# Altium schematic sheet BluetoothHID.SchDoc
size 420 x 297 mm; SheetNumber: 3; SheetTotal: 11; SPICEModelCacheQTASARTU: <root> / <DocumentId>QTASARTU</DocumentId> / <CacheFrame Number="0"> / <Model Name="0603_885012206095_100nf" Kind="CKT"> / <Text>******* / .subckt 0603_885012206095_100nF 1 2 / Rser 1 3 0.0157659152881 / Lser 2 4 3.10171966E-10 / C1 3 4 0.0000001 / Rpar 3 4 5000000000 / .ends 0603_885012206095_100nF</Text> / </Model> / <Model Name="0603_885012106006_10uf" Kind="CKT"> / <Text>******* / .subckt 0603_885012106006_10uF 1 2 / Rser 1 3 0.00407641026021 / Lser 2 4 4.16060333E-10 / C1 3 4 0.00001 / Rpar 3 4 5000000 / .ends 0603_885012106006_10uF</Text> / </Model> / </CacheFrame> / </root>
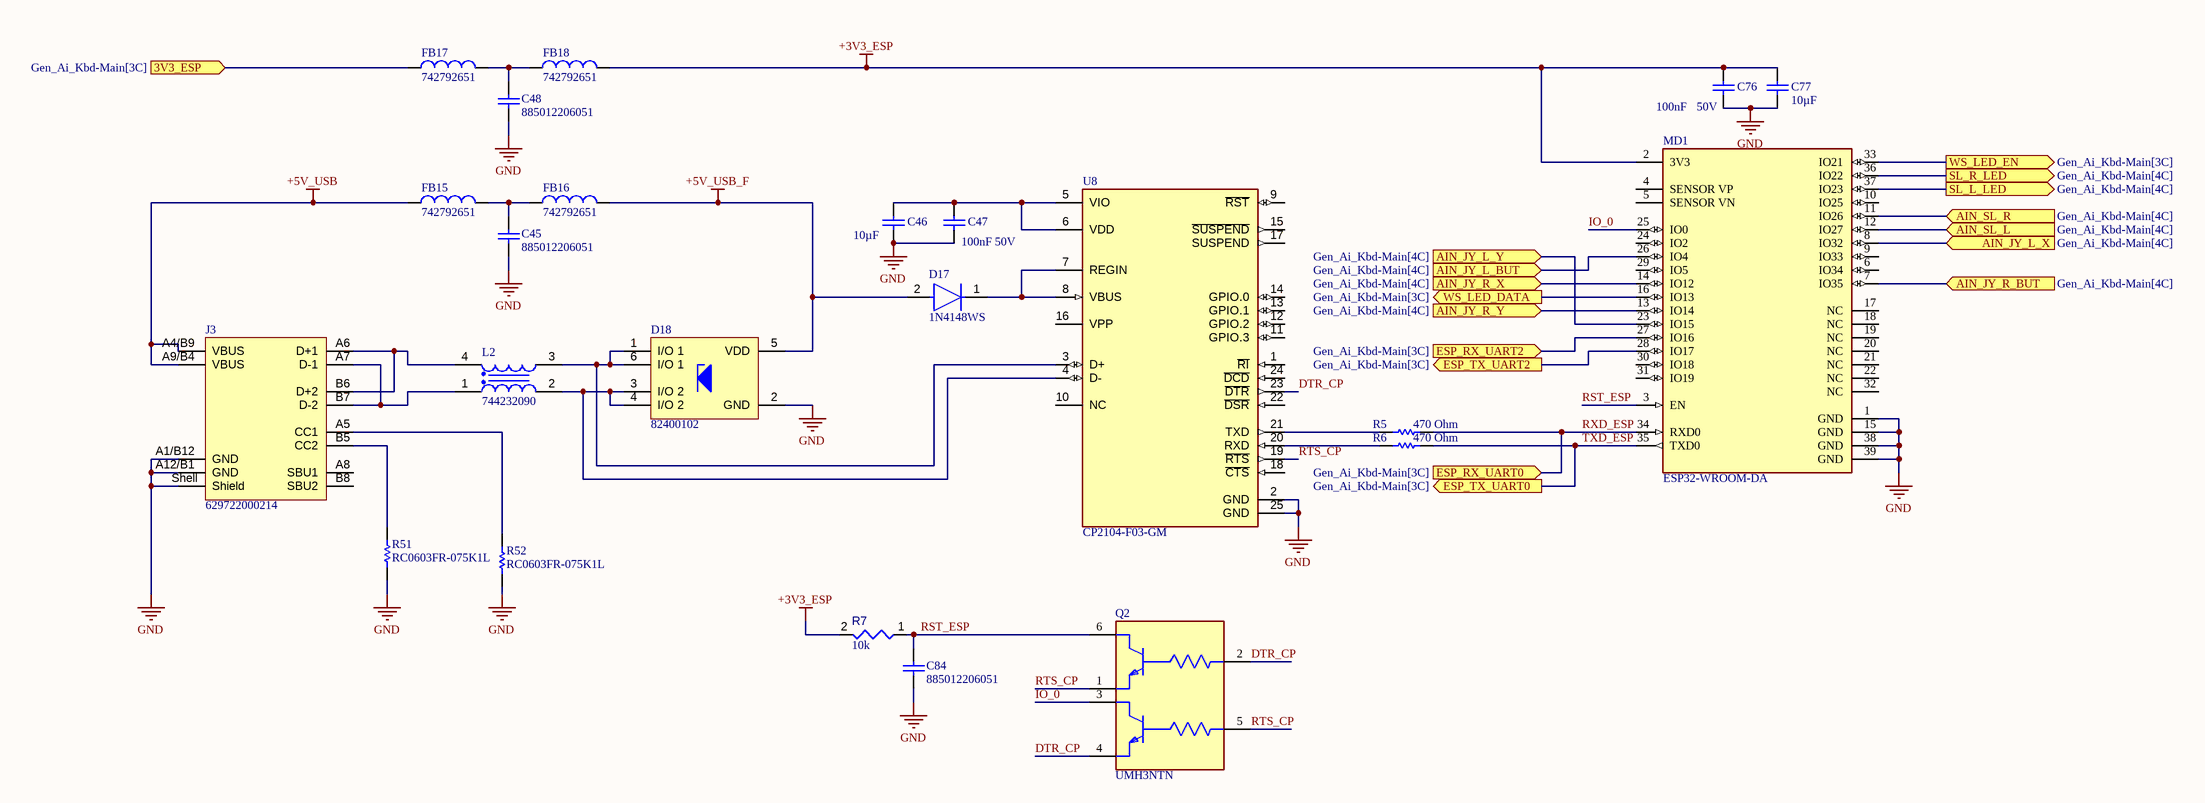
[diagram p0: BluetoothHID.SchDoc]

## Parts
C45  885012206051  [WCAP-CSGP_0603_L1.6W0.8H0.8_Reflow]
C46  Capacitance: 10µF  [WCAP-CSGP_0603_L1.6W0.8H0.8_Reflow]  (hidden comment: 885012106006)
C47  Capacitance: 100nF  Rated Voltage (DC): 50V  [WCAP-CSGP_0603_L1.6W0.8H0.8_Reflow]  (hidden comment: 885012206095)
C48  885012206051  [WCAP-CSGP_0603_L1.6W0.8H0.8_Reflow]
C76  Capacitance: 100nF  Rated Voltage (DC): 50V  [WCAP-CSGP_0603_L1.6W0.8H0.8_Reflow]  (hidden comment: 885012206095)
C77  Capacitance: 10µF  [WCAP-CSGP_0603_L1.6W0.8H0.8_Reflow]  (hidden comment: 885012106006)
C84  885012206051  [WCAP-CSGP_0603_L1.6W0.8H0.8_Reflow]
D17  1N4148WS  [FP-477AB-IPC_C]
D18  82400102  [WE-TVS_SOT23-6L]
FB15  742792651  [WE-CBF_0603_L1.6W0.8H0.8_HC]
FB16  742792651  [WE-CBF_0603_L1.6W0.8H0.8_HC]
FB17  742792651  [WE-CBF_0603_L1.6W0.8H0.8_HC]
FB18  742792651  [WE-CBF_0603_L1.6W0.8H0.8_HC]
J3  629722000214  [629722000214]
L2  744232090  [WE-CNSW_1206]
MD1  ESP32-WROOM-DA  [FP-ESP32-WROOM-DA]
Q2  UMH3NTN  [FP-UMT6-IPC_C]
R5  Resistance: 470 Ohm  [RESC1608X55X25LL10T15]  (hidden comment: RC0603FR-07470RL)
R6  Resistance: 470 Ohm  [RESC1608X55X25LL10T15]  (hidden comment: RC0603FR-07470RL)
R7  value 10k  [RESC1608X55X25ML10T15]  (hidden comment: Resistor 10k +/-1% 0603 100 mW)
R51  RC0603FR-075K1L  [RESC1608X55X25ML10T15]
R52  RC0603FR-075K1L  [RESC1608X55X25ML10T15]
U8  CP2104-F03-GM  [FP-CP2104-F03-GM-MFG]

## Ports
3V3_ESP (in, see Gen_Ai_Kbd-Main[3C]), AIN_JY_L_BUT (in, see Gen_Ai_Kbd-Main[4C]), AIN_JY_L_X (in, see Gen_Ai_Kbd-Main[4C]), AIN_JY_L_Y (in, see Gen_Ai_Kbd-Main[4C]), AIN_JY_R_BUT (in, see Gen_Ai_Kbd-Main[4C]), AIN_JY_R_X (in, see Gen_Ai_Kbd-Main[4C]), AIN_JY_R_Y (in, see Gen_Ai_Kbd-Main[4C]), AIN_SL_L (in, see Gen_Ai_Kbd-Main[4C]), AIN_SL_R (in, see Gen_Ai_Kbd-Main[4C]), ESP_RX_UART0 (in, see Gen_Ai_Kbd-Main[3C]), ESP_RX_UART2 (in, see Gen_Ai_Kbd-Main[3C]), ESP_TX_UART0 (out, see Gen_Ai_Kbd-Main[3C]), ESP_TX_UART2 (out, see Gen_Ai_Kbd-Main[3C]), SL_L_LED (out, see Gen_Ai_Kbd-Main[4C]), SL_R_LED (out, see Gen_Ai_Kbd-Main[4C]), WS_LED_DATA (out, see Gen_Ai_Kbd-Main[3C]), WS_LED_EN (out, see Gen_Ai_Kbd-Main[3C])

## Nets
+3V3_ESP: C76.2 C77.2 FB18.2 MD1.2(3V3) R7.2
+5V_USB: FB15.1 J3.A4/B9(VBUS) J3.A9/B4(VBUS)
+5V_USB_F: D17.2(A) D18.5(VDD) FB16.2
GND: C45.1 C46.1 C47.1 C48.1 C76.1 C77.1 C84.1 D18.2(GND) J3.A1/B12(GND) J3.A12/B1(GND) J3.Shell(Shield) MD1.1(GND) MD1.15(GND) MD1.38(GND) MD1.39(GND) R51.1 R52.1 U8.2(GND) U8.25(GND)
3V3_ESP: FB17.1 ; port 3V3_ESP
AIN_JY_L_BUT: MD1.26(IO4) ; port AIN_JY_L_BUT
AIN_JY_L_X: MD1.8(IO32) ; port AIN_JY_L_X
AIN_JY_L_Y: MD1.23(IO15) ; port AIN_JY_L_Y
AIN_JY_R_BUT: MD1.7(IO35) ; port AIN_JY_R_BUT
AIN_JY_R_X: MD1.14(IO12) ; port AIN_JY_R_X
AIN_JY_R_Y: MD1.13(IO14) ; port AIN_JY_R_Y
AIN_SL_L: MD1.12(IO27) ; port AIN_SL_L
AIN_SL_R: MD1.11(IO26) ; port AIN_SL_R
DTR_CP: Q2.2(B) Q2.4(E) U8.23(~{DTR})
ESP_RX_UART2: MD1.27(IO16) ; port ESP_RX_UART2
ESP_TX_UART2: MD1.28(IO17) ; port ESP_TX_UART2
IO_0: MD1.25(IO0) Q2.3(C)
RST_ESP: C84.2 MD1.3(EN) Q2.6(C) R7.1
RTS_CP: Q2.1(E) Q2.5(B) U8.19(~{RTS})
RXD_ESP: MD1.34(RXD0) R5.2 ; port ESP_RX_UART0
SL_L_LED: MD1.37(IO23) ; port SL_L_LED
SL_R_LED: MD1.36(IO22) ; port SL_R_LED
TXD_ESP: MD1.35(TXD0) R6.2 ; port ESP_TX_UART0
WS_LED_DATA: MD1.16(IO13) ; port WS_LED_DATA
WS_LED_EN: MD1.33(IO21) ; port WS_LED_EN
NetC45_2: C45.2 FB15.2 FB16.1
NetC46_2: C46.2 C47.2 U8.5(VIO) U8.6(VDD)
NetC48_2: C48.2 FB17.2 FB18.1
NetD17_1: D17.1(C) U8.7(REGIN) U8.8(VBUS)
NetD18_1: D18.1(I/O_1) D18.6(I/O_1) L2.3 U8.3(D+)
NetD18_3: D18.3(I/O_2) D18.4(I/O_2) L2.2 U8.4(D-)
NetJ3_A5: J3.A5(CC1) R52.2
NetJ3_A6: J3.A6(D+1) J3.B6(D+2) L2.4
NetJ3_A7: J3.A7(D-1) J3.B7(D-2) L2.1
NetJ3_B5: J3.B5(CC2) R51.2
NetR5_1: R5.1 U8.21(TXD)
NetR6_1: R6.1 U8.20(RXD)

Not connected (* = marked no-connect by the designer): J3 A8(SBU1) B8(SBU2); MD1 4(SENSOR_VP) 5(SENSOR_VN) 6(IO34) 9(IO33) 10(IO25) 17(NC) 18(NC) 19(NC) 20(NC) 21(NC) 22(NC) 24(IO2) 29(IO5) 30(IO18) 31(IO19) 32(NC); U8 1(~{RI}) 9(~{RST}) 10(NC) 11(GPIO.3) 12(GPIO.2) 13(GPIO.1) 14(GPIO.0) 15(~{SUSPEND}) 16(VPP) 17(SUSPEND) 18(~{CTS}) 22(~{DSR}) 24(~{DCD})

## Notes on the sheet
- THIS DOCUMENT AND THE DATA DISCLOSED HEREIN OR
- HEREWITH IS THE PROPERTY OF SUMASTA TECH AND MAY
- DWG NO:
- REVISION
- REV:
- DESCRIPTION
- DATE
- APPROVED
- BE FREELY DISTRIBUTED IN WHOLE. NO RIGHTS ARE
- THIS DOCUMENT IS SUBJECT TO CHANGE WITHOUT NOTICE
- RESERVED OR EXPRESS OR IMPLIED WARANTEE GIVEN.
- PROJECT
- sumasta
- t
- PROJECT REVISION:
- TITLE
- DOCUMENT REVISION:
- DESIGN ITEM:
- SCALE:
- A3
- SIZE
- CAGE CODE
- FILE NAME
- DWG NO.
- SHEET
- OF
- REV

## Library data of the parts
C45 C48 C84 = CMP-03913-53914760-1: 885012206051 Cap Cer 0.68UF 16V X7R 0603; Insulation Resistance: 700MΩ; Tolerance: 10%; Capacitance: 680nF; NexarPartId: 53914760; Dielectric: X7R; Max Operating Temperature: 125°C; Thickness: 939.8µm; Case Code (Imperial): 0603; Length: 1.6mm; RoHS: Compliant; Min Operating Temperature: -55°C; Width: 800µm; Mount: Surface Mount; Height: 800µm; Case/Package: 0603; Case Code (Metric): 1608; Voltage Rating (DC): 16V; Packaging: Tape & Reel (TR); Voltage Rating: 16V
C46 C77 = CMP-007-000403-1: WCAP-CSGP Multilayer Ceramic Chip Capacitor, General Purpose, size 0603, X5R, 10µF, 6.3VDC; Manufacturer: Wurth Elektronik; Rated Voltage (DC): 6.3V; Insulation Resistance: 0.01GO; Technical Reference: X5R0603106M6R3DFCT10000; Dissipation Factor: 10%; Case/Size Code: 0603; Capacitance Tolerance: +/-20%; Mount: Surface Mount; Packaging: Tape and Reel; ComponentLink1URL: https://www.we-online.com/redexpert/article/885012106006?ad; Height: 0.8mm; ComponentLink2URL: https://www.we-online.com/redexpert/spec/885012106006?ad; Category: Multilayer Ceramic Chip Capacitors; Operating Temperature Max: 85°C; Operating Temperature Min: -55°C; Source: WCAP-CSGP.SchLib; Match Code: WCAP-CSGP; Design Item ID: 885012106006; Ceramic Type: X5R; Manufacturer Part Number: 885012106006; Component Type: Standard; Pin Count: 2; Width: 0.8mm; ComponentLink2Description: Datasheet Link; ComponentLink1Description: Website Link; Length: 1.6mm
C47 C76 = CMP-007-000655-1: WCAP-CSGP Multilayer Ceramic Chip Capacitor, General Purpose, size 0603, X7R, 100nF, 50VDC; Manufacturer: Wurth Elektronik; Capacitance Tolerance: +/-10%; Insulation Resistance: 5GO; Case/Size Code: 0603; Technical Reference: X7R0603104K050DFCT10000; Dissipation Factor: 3%; Operating Temperature Max: 125°C; Category: Multilayer Ceramic Chip Capacitors; ComponentLink1Description: Website Link; Manufacturer Part Number: 885012206095; Pin Count: 2; Ceramic Type: X7R; Component Type: Standard; Mount: Surface Mount; Operating Temperature Min: -55°C; Source: WCAP-CSGP.SchLib; ComponentLink2URL: https://www.we-online.com/redexpert/spec/885012206095?ad; Packaging: Tape and Reel; Match Code: WCAP-CSGP; Width: 0.8mm; ComponentLink1URL: https://www.we-online.com/redexpert/article/885012206095?ad; Height: 0.8mm; Design Item ID: 885012206095; Length: 1.6mm; ComponentLink2Description: Datasheet Link
D17 = CMP-07163-000040-1: DIODE GEN PURP 75V 150MA SOD323F; Forward Voltage: 1V; Power Dissipation: 200mW; Element Configuration: Single; Max Forward Surge Current (Ifsm): 2A; Peak Reverse Current: 5uA; Recovery Time: 4ns; Package Quantity: 1; Number of Pins: 2; Height: 1mm; REACH SVHC: No SVHC; Max Reverse Voltage (DC): 75V; Forward Current: 150mA; Length: 1.8mm; Max Repetitive Reverse Voltage (Vrrm): 75V; Max Operating Temperature: 150°C; Average Rectified Current: 150mA; Contact Plating: Tin; Packaging: Tape and Reel; Radiation Hardening: No; Min Operating Temperature: -55°C; Width: 1.35mm; Weight: 0.0276g; Lead Free: Lead Free; Mount: Surface Mount; Reverse Voltage: 75V; Reverse Recovery Time: 4ns
D18 = CMP-1486-00007-2: NexarPartId: 22862942; Max Reverse Leakage Current: 5A; Test Current: 1mA; Number of Channels: 2; Leakage Current: 5µA; Min Breakdown Voltage: 6V; Working Voltage: 5V; Direction: Unidirectional; Max Surge Current: 6A; Element Configuration: Dual; ESD Protection: Yes; Capacitance: 2pF; Forward Voltage: 800mV; Polarity: Bidirectional; Clamping Voltage: 7.7V; RoHS: Compliant; Number of Bidirectional Channels: 2; Mount: Surface Mount; Number of Pins: 6; Case/Package: SOT-23; Length: 2.9mm; Min Operating Temperature: -55°C; REACH SVHC: Unknown; Max Operating Temperature: 125°C; Max Breakdown Voltage: 6V; Reverse Standoff Voltage: 5V; Width: 2.8mm; Breakdown Voltage: 6V; Height: 1.16mm; Termination: SMD/SMT; Power Line Protection: Yes; Operating Supply Voltage: 6V; Packaging: Digi-Reel®; Peak Pulse Current: 6A
FB15-FB18 = CMP-0220-00181-3: NexarPartId: 7864500; RMS Current (Irms): 1A; Number of Lines: 1; Test Frequency: 100MHz; Impedance: 600Ω; Inductance: 360mH; Resistance: 200mΩ; Tolerance: 25%; Case Code (Imperial): 0603; Lead Free: Lead Free; Current Rating: 1A; Height: 800µm; Min Operating Temperature: -55°C; Core Material: Ferrite; REACH SVHC: Unknown; Case/Package: 0603; Weight: 3.997283mg; Mount: Surface Mount; Termination: SMD/SMT; Case Code (Metric): 1608; DC Resistance (DCR): 200mΩ; Series Resistance: 200mΩ; Max Operating Temperature: 125°C; Width: 800µm; Length: 1.6mm; Max DC Current: 1A; RoHS: Compliant; Material: Ferrite; Max Current Rating: 1A; Depth: 800µm; Packaging: Cut Tape (CT)
J3 = CMP-207978-000003-2: Conenctor USB 2.0 Type C Horizontal SMT; NexarPartId: 129483980; USB Standard: USB 2.0; Gender: Receptacle; Current Rating: 5A; Insulation Resistance: 100MΩ; Pin Length: 950µm; Voltage Rating: 20V; Number of Contacts: 12; Height: 3.51mm; Packaging: Tape and Reel; Number of Pins: 16; Min Operating Temperature: -40°C; Max Operating Temperature: 85°C; RoHS: Compliant; Contact Material: Gold, Nickel
L2 = CMP-0222-00035-2: NexarPartId: 7861718; Voltage Rating: 50V; Frequency: 100MHz; Max Current Rating: 370mA; Tolerance: 25%; Impedance: 90Ω; Core Material: Ferrite; Inductance: 111nH; Number of Lines: 2; DC Resistance (DCR): 300mΩ; Packaging: Digi-Reel®; REACH SVHC: No SVHC; Weight: 39.008944mg; Voltage Rating (AC): 50V; Max Operating Temperature: 125°C; Height: 1.8mm; Current: 370mA; RoHS: Compliant; Mount: Surface Mount; Min Operating Temperature: -40°C; Ambient Temperature Range Low: -40°C; Test Frequency: 100MHz; Width: 1.6mm; Ambient Temperature Range High: 85°C; Lead Free: Lead Free; Termination: SMD/SMT; Current Rating: 370mA; Voltage Rating (DC): 50V; Depth: 1.6mm; Number of Pins: 4; Length: 3.2mm; Resistance: 300mΩ; Max DC Current: 370mA; Case/Package: 1206
MD1 = CMP-021-00008-1: WiFi-Modul 802.11/BT 2, 4-2, 5GHz 150Mb/s, dual antenna
Q2 = CMP-08979-000010-1: TRANS 2NPN PREBIAS 0.15W UMT6; Transition Frequency: 250MHz; Collector Base Voltage (VCBO): 50V; Element Configuration: Dual; Emitter Base Voltage (VEBO): 5V; Max Collector Current: 100mA; Polarity: NPN; hFE Min: 100; Max Power Dissipation: 150mW; Collector-emitter Voltage-Max: 300mV; Collector Emitter Voltage (VCEO): 50V; Package Quantity: 1; Series: -; Case/Package: SOT-363; REACH SVHC: No SVHC; Number of Pins: 6; Operating Supply Voltage: 50V; Min Operating Temperature: -55°C; Mount: Surface Mount; Max Output Current: 100mA; Current Rating: 100mA; Lead Free: Lead Free; Continuous Collector Current: 100mA; Packaging: Tape and Reel; Max Operating Temperature: 150°C; Radiation Hardening: No; Max Breakdown Voltage: 50V; Voltage Rating (DC): 50V; Power Dissipation: 150mW; RoHS Compliant: Yes; Collector Emitter Breakdown Voltage: 50V
R5 R6 = CMP-1659-00035-2: General Purpose Chip Resistor, 470 Ohm, +/- 1%, -55 to 155 degC, 0603 (1608 Metric), RoHS, Tape and Reel; ComponentLink1Description: Manufacturer URL; Contact Plating: Gold; Width: 3.1 mm; Radiation Hardening: No; DatasheetVersion: Rev. 4, 04/2009; Length: 3 mm; PackageDescription: 2-Pin Surface Mount Device, Body 1.6 x 0.8 mm; ComponentLink1URL: http://www.yageo.com/; Min Operating Temperature: -40 degC; Mount: Surface Mount; Package Quantity: 2500; ComponentLink2URL: https://datasheet.ciiva.com/11808/0900766b80f96399-11808177.pdf; RoHSCompliant: true; Fastening Type: Snap; PackageReference: 0603; Max Operating Temperature: 90 degC; Height: 1.25 mm; Packaging: Tape and Reel; ComponentLink2Description: Datasheet; Contact Material: Brass
R7 = CMP-009-00017-5: Chip Resistor, 10 KOhm, +/- 1%, 01 W, -55 to 155 degC, 0603 (1608 Metric); Voltage Rating: 50V; Power: 100mW; RoHS Compliant: True; Min Operating Temperature: -55°C; Pins: 2; Case/Package: 0603; Mounting Technology: SM; Max Operating Temperature: 155°C; Tolerance: 1%
R51 R52 = CMP-2000-04091-1: Manufacturer: Yageo; Part Number: RC0603FR-075K1L
U8 = CMP-0511-00004-2: IC SGL USB-TO-UART BRIDGE 24QFN; Number of Transceivers: 1; Max Supply Voltage: 3.6V; Operating Supply Current: 17mA; Operating Supply Voltage: 3.3V; Data Rate: 2Mbps; Min Supply Voltage: 3V; Number of Channels: 1; Max Operating Temperature: 85°C; Contact Plating: Tin; Min Operating Temperature: -40°C; Number of Pins: 24; Case/Package: QFN; Packaging: Rail/Tube; Radiation Hardening: No; Weight: 0.001764oz